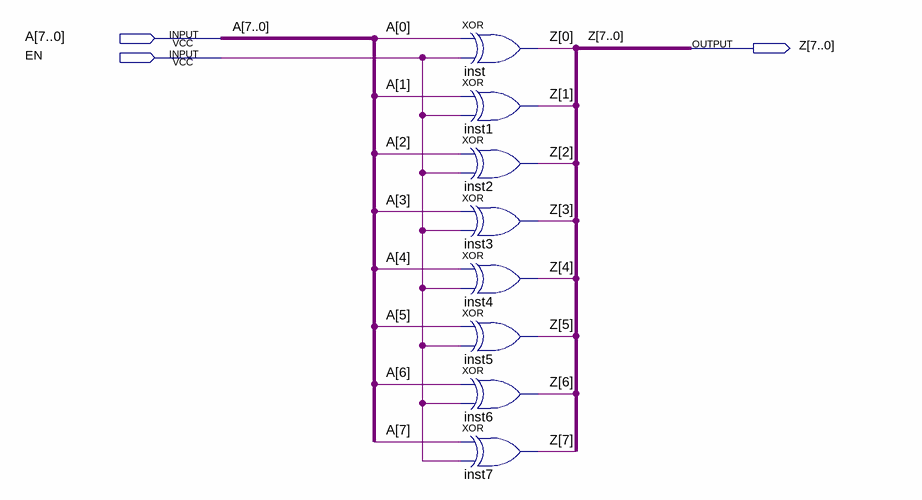
[diagram p0: schematic sheet]
// Quartus schematic bitwise_inv.bdf as structural Verilog: 8 symbols, 3 pins
module bitwise_inv (
  input  [7:0] A,
  input  EN,
  output [7:0] Z
);

  xor inst (Z[0], A[0], EN);
  xor inst1 (Z[1], A[1], EN);
  xor inst2 (Z[2], A[2], EN);
  xor inst3 (Z[3], A[3], EN);
  xor inst4 (Z[4], A[4], EN);
  xor inst5 (Z[5], A[5], EN);
  xor inst6 (Z[6], A[6], EN);
  xor inst7 (Z[7], A[7], EN);
endmodule
